# Altium schematic sheet TK514_Interrupter.SchDoc: TK514 Interrupter
size A3; PageSetup: Record=PageOptions|CenterHorizontal=False|CenterVertical=False|PrintScale=0.97|XCorrection=1.00|YCorrection=1.00|PrintKind=1|BorderSize=5000000|LeftOffset=0|BottomOffset=0|Orientation=2|PaperLength=1000|PaperWidth=1000|Scale=100|PaperSource=7|PrintQuality=-4|MediaType=1|DitherType=10|PaperKind=A4|PrintScaleMode=1; Author: Øystein Smith; Organization: Omega Verksted; DocumentNumber: 8; Revision: 0; SheetNumber: 8; SheetTotal: 20
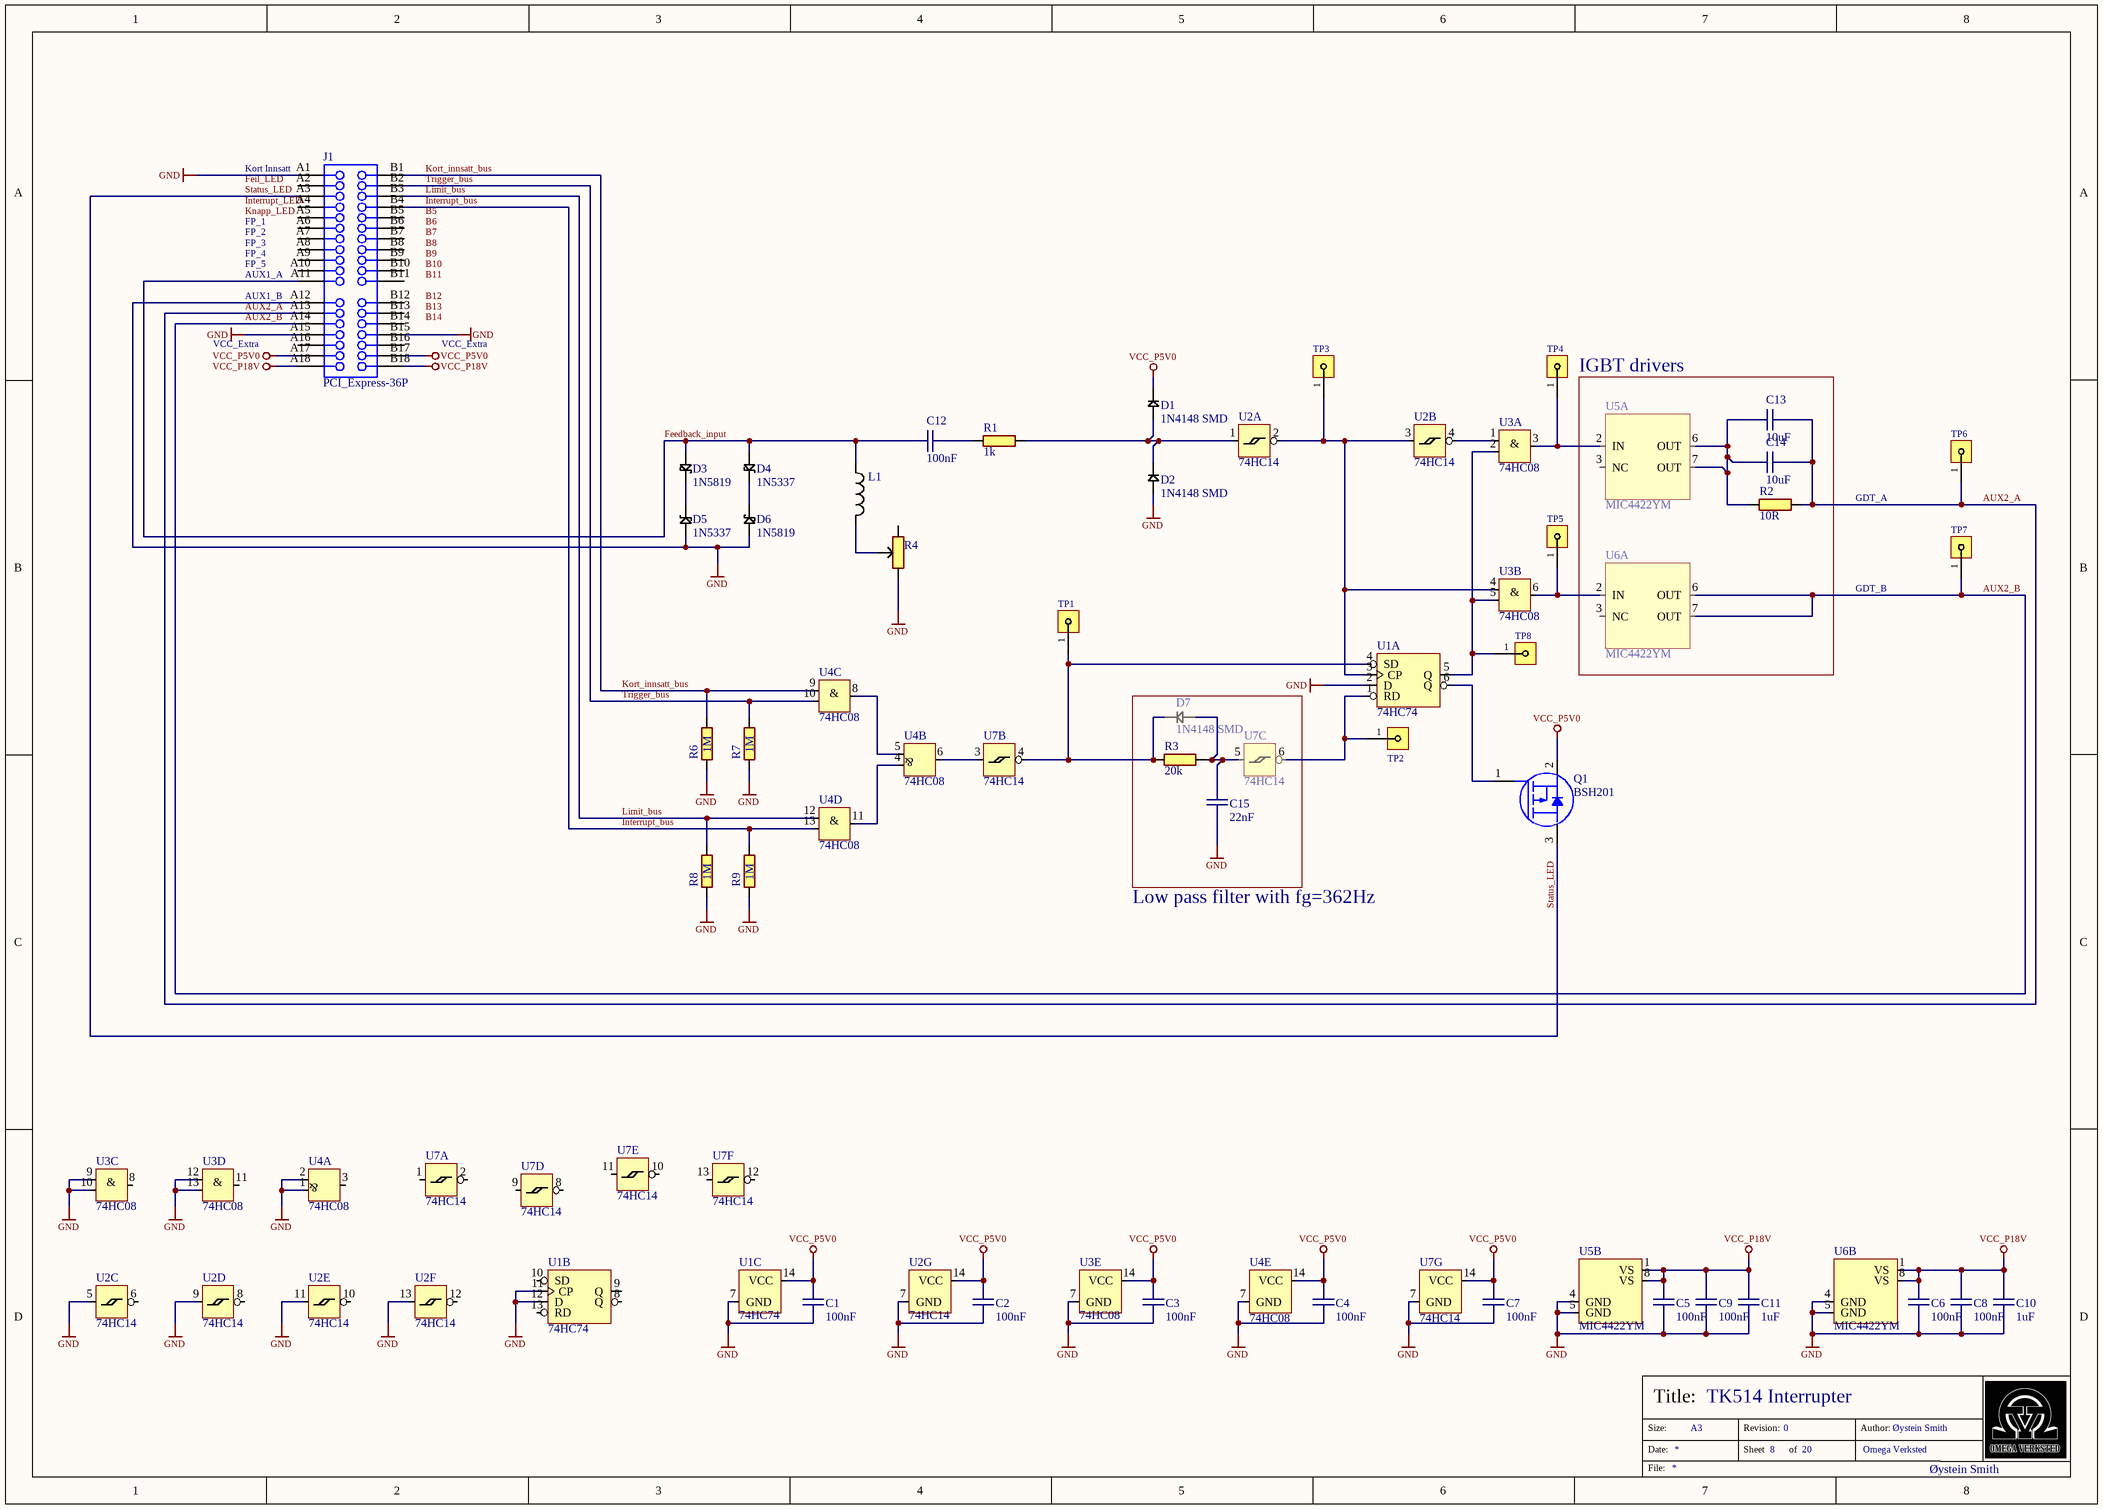
[diagram p0: TK514_Interrupter.SchDoc]

## Parts
C1  100nF  [CAPC0603(1608)55_N]
C2  100nF  [CAPC0603(1608)55_N]
C3  100nF  [CAPC0603(1608)55_N]
C4  100nF  [CAPC0603(1608)55_N]
C5  100nF  [CAPC0603(1608)55_N]
C6  100nF  [CAPC0603(1608)55_N]
C7  100nF  [CAPC0603(1608)55_N]
C8  100nF  [CAPC0603(1608)55_N]
C9  100nF  [CAPC0603(1608)55_N]
C10  1uF  [CAPC1206(3216)170_N]
C11  1uF  [CAPC1206(3216)170_N]
C12  100nF  [CAPC0603(1608)55_N]
C13  10uF  [CAPC1206(3216)170_N]
C14  10uF  [CAPC1206(3216)170_N]
C15  22nF  [CAPC0805(2012)100_N]
D1  1N4148 SMD  [SOD123]
D2  1N4148 SMD  [SOD123]
D3  1N5819  [DO-41]
D4  1N5337  [DO-29]
D5  1N5337  [DO-29]
D6  1N5819  [DO-41]
D7  1N4148 SMD  [SOD123]
J1  PCI_Express-36P  [PCIeX1-GF-2D-1000-1K-O36]
L1  Spole 15H  [INDP3225X20N]  (value not drawn)
Q1  BSH201  [SOT23-3_N]
R1  1k  [RESC0603(1608)_N]
R2  10R  [RESC0805(2012)_N]
R3  20k  [RESC0603(1608)_N]
R4  Trimmepot 100ohm  [TRIMPOT_3006P]  (value not drawn)
R6  1M  [RESC0603(1608)_N]
R7  1M  [RESC0603(1608)_N]
R8  1M  [RESC0603(1608)_N]
R9  1M  [RESC0603(1608)_N]
TP1  Header1x1  [HDRV1W64P254_1X1_254X254X900B]  (value not drawn)
TP2  Header1x1  [HDRV1W64P254_1X1_254X254X900B]  (value not drawn)
TP3  Header1x1  [HDRV1W64P254_1X1_254X254X900B]  (value not drawn)
TP4  Header1x1  [HDRV1W64P254_1X1_254X254X900B]  (value not drawn)
TP5  Header1x1  [HDRV1W64P254_1X1_254X254X900B]  (value not drawn)
TP6  Header1x1  [HDRV1W64P254_1X1_254X254X900B]  (value not drawn)
TP7  Header1x1  [HDRV1W64P254_1X1_254X254X900B]  (value not drawn)
TP8  Header1x1  [HDRV1W64P254_1X1_254X254X900B]  (value not drawn)
U1  74HC74  [SOIC-14]  (parts A,B,C of 3)
U2  74HC14  [SOIC-14]  (parts A,B,C,D,E,F,G of 7)
U3  74HC08  [SOIC-14]  (parts A,B,C,D,E of 5)
U4  74HC08  [SOIC-14]  (parts A,B,C,D,E of 5)
U5  MIC4422YM  [SOIC-8-WIDE]  (parts A,B of 2)
U6  MIC4422YM  [SOIC-8-WIDE]  (parts A,B of 2)
U7  74HC14  [SOIC-14]  (parts A,B,C,D,E,F,G of 7)

## Blocks framed on the sheet
IGBT drivers: C13 C14 R2 U5 U6

## Nets
GND: C1.1 C2.1 C3.1 C4.1 C5.1 C6.1 C7.1 C8.1 C9.1 C10.1 C11.1 C15.1 D2.1(A) D5.1(A) D6.1(A) J1.A1 J1.A12 J1.A15 J1.B15 R4.1 R6.1 R7.1 R8.1 R9.1 U1.2(D) U1.7(GND) U1.11(CP) U1.12(D) U2.5 U2.7(GND) U2.9 U2.11 U2.13 U3.7(GND) U3.9 U3.10 U3.12 U3.13 U4.1 U4.2 U4.7(GND) U5.4(GND) U5.5(GND) U6.4(GND) U6.5(GND) U7.7(GND)
VCC_P5V0: C1.2 C2.2 C3.2 C4.2 C7.2 D1.2(K) J1.A17 J1.B17 Q1.2(Source) U1.14(VCC) U2.14(VCC) U3.14(VCC) U4.14(VCC) U7.14(VCC)
VCC_P18V: C5.2 C6.2 C8.2 C9.2 C10.2 C11.2 J1.A18 J1.B18 U5.1(VS) U5.8(VS) U6.1(VS) U6.8(VS)
AUX2_A: C13.2 C14.2 J1.A13 R2.2 TP6.1
AUX2_B: J1.A14 TP7.1 U6.6(OUT) U6.7(OUT)
Feedback_input: C12.1 D3.1(A) D4.1(A) J1.A11 L1.1
Interrupt_bus: J1.B4 R9.2 U4.13
Kort_innsatt_bus: J1.B1 R6.2 U4.9
Limit_bus: J1.B3 R8.2 U4.12
Status_LED: J1.A3 Q1.3(Drain)
Trigger_bus: J1.B2 R7.2 U4.10
NetC12_2: C12.2 R1.1
NetC13_1: C13.1 C14.1 R2.1 U5.6(OUT) U5.7(OUT)
NetC15_2: C15.2 D7.1(A) R3.2 U7.5
NetD1_1: D1.1(A) D2.2(K) R1.2 U2.1
NetD3_2: D3.2(K) D5.2(K)
NetD4_2: D4.2(K) D6.2(K)
NetD7_2: D7.2(K) R3.1 TP1.1 U1.4(SD) U7.4
NetL1_2: L1.2 R4.2
NetQ1_1: Q1.1(Gate) U1.6(Q)
NetTP2_1: TP2.1 U1.1(RD) U7.6
NetTP3_1: TP3.1 U1.3(CP) U2.2 U2.3 U3.4
NetTP4_1: TP4.1 U3.3 U5.2(IN)
NetTP5_1: TP5.1 U3.6 U6.2(IN)
NetTP8_1: TP8.1 U1.5(Q) U3.2 U3.5
NetU2_4: U2.4 U3.1
NetU4_4: U4.4 U4.11
NetU4_5: U4.5 U4.8
NetU4_6: U4.6 U7.3

Not connected (* = marked no-connect by the designer): J1 A2 A4 A5 A6 A7 A8 A9 A10 A16 B5 B6 B7 B8 B9 B10 B11 B12 B13 B14 B16; R4 3; U1 8(Q) 9(Q) 10(SD) 13(RD); U2 6 8 10 12; U3 8 11; U4 3; U5 3(NC); U6 3(NC); U7 1 2 8 9 10 11 12 13

## Notes on the sheet
- (near J1) Kort Innsatt
- FP_1
- FP_2
- FP_3
- FP_4
- FP_5
- (near J1) AUX1_B
- (near J1) AUX1_A
- VCC_Extra
- GDT_A
- GDT_B
- Low pass filter with fg=362Hz
- Øystein Smith
- Labels drawn without touching a wire or pin: B5, B6, B7, B8, B9, B10, B11, B12, B13, B14, Feil_LED, Interrupt_LED, Knapp_LED
- Size:
- Date:
- Title:
- A3
- Revision:
- Sheet
- of
- Author:
- File:
- (in symbol 3238, part A) &
- (in symbol 3238, part B) &
- (in symbol 3238, part C) &
- (in symbol 3238, part D) &

## Library data of the parts
C1-C9 C12 = 5152: X7R 50V 5%; id: 5152; pakke_opprettet_av: 815; leverandor_varenr: 1759122; pris: 1; nokkelord: Kondensator, Capacitor, CAP; produsent: Multicomp; leverandor: Farnell; pakketype: 0603; rad: 21; rom: OV; lager_type: Baklager; dybde: 0; antall: 1000; komponenttype: 2; pakke_opprettet: 18/02/2015 14:18:13; symbol_opprettet_av: 815; symbol_opprettet: 14/11/2014 20:19:34; navn: 100nF; hylle: 0
C10 C11 = 5154: X7R 50V; id: 5154; pakke_opprettet_av: 815; leverandor_varenr: 1759454; pris: 2; nokkelord: Kondensator, capacitor; produsent: Multicomp; leverandor: Farnell; pakketype: 1206; pakke_opprettet: 11/02/2015 13:21:22; symbol_opprettet_av: 815; symbol_opprettet: 14/11/2014 20:19:34; navn: 1uF; komponenttype: 2
C13 C14 = 5059: X5R 50V 10%; id: 5059; pakke_opprettet_av: 815; leverandor_varenr: 2672214; pris: 6; nokkelord: Kondensator, capacitor; produsent: Murata; leverandor: Farnell; pakketype: 1206; komponenttype: 2; pakke_opprettet: 11/02/2015 13:21:22; symbol_opprettet_av: 815; symbol_opprettet: 14/11/2014 20:19:34; navn: 10uF
C15 = 3491: X7R 50V; id: 3491; pakke_opprettet_av: 815; pris: 1; nokkelord: Capacitor Cap Kondis; pakketype: 0805; rad: 5; rom: OV; lager_type: Baklager; dybde: 2; hylle: 4; antall: 15; leverandor_varenr: 1414682; produsent: Multicomp; leverandor: Farnell; pakke_opprettet: 14/11/2014 20:52:01; symbol_opprettet_av: 815; symbol_opprettet: 14/11/2014 20:19:34; navn: 22nF; komponenttype: 2
D1 D2 D7 = 4485: SMD signaldiode; id: 4485; rad: 3; rom: OV; lager_type: Fremlager; dybde: 2; antall: 894; pakke_opprettet_av: 1165; symbol_opprettet_av: 815; leverandor_varenr: 8150206; pris: 1; produsent: Taiwan Semiconductor; leverandor: Farnell; komponenttype: 9; hylle: 2; pakke_opprettet: 11/05/2018 20:10:55; symbol_opprettet: 28/06/2014 15:10:17; navn: 1N4148 SMD; pakketype: SOD123
D3 D6 = 5238: Schottkydiode, 1A, 40V; id: 5238; rad: 0; rom: OV; lager_type: Fremlager; hylle: 2; antall: 25; pakke_opprettet_av: 815; leverandor_varenr: 1336533; nokkelord: schottky, diode; produsent: Multicomp; leverandor: Farnell; pakketype: DO; komponenttype: 9; dybde: 0; pakke_opprettet: 28/06/2014 16:50:18; symbol_opprettet_av: 815; symbol_opprettet: 28/06/2014 15:20:09; navn: 1N5819; pris: 2
D4 D5 = 3264: Zenerdiode 4.7V 5W; id: 3264; pakke_opprettet_av: 815; leverandor_varenr: 9557946; pris: 5; produsent: ON Semiconductor; leverandor: Farnell; pakketype: DO; komponenttype: 9; pakke_opprettet: 28/06/2014 16:16:55; symbol_opprettet_av: 815; symbol_opprettet: 28/06/2014 15:11:05; navn: 1N5337
J1 = 3037: PCI express PCB kortkankonnektor; pakke_opprettet_av: 815; pris: 0; id: 3037; komponenttype: 11; produsent: PCB feature; navn: PCIeX1-GF-2D-1000-1K-O36; pakke_opprettet: 07/06/2015 17:49:10; symbol_opprettet_av: 815; symbol_opprettet: 06/07/2014 17:26:37; pakketype: -
L1 = 6201: Wirewound Inductor, 15 µH, 2.8 ohm, 20 MHz, 130 mA; id: 6201; pakke_opprettet_av: 924; pris: 4; pakketype: 1210; leverandor_varenr: 2747875; nokkelord: Spole, coil, inductor, wirewound; produsent: TDK; leverandor: Farnell; komponenttype: 3; pakke_opprettet: 26/05/2015 23:51:10; symbol_opprettet_av: 924; symbol_opprettet: 27/05/2015 00:20:21; navn: Spole 15H
Q1 = 3085: P-Channel MOSFET 300mA; id: 3085; pakke_opprettet_av: 815; symbol_opprettet_av: 1150; leverandor_varenr: 1758073; pris: 3; produsent: NXP Semiconductors; leverandor: Farnell; pakketype: SOT; rom: OV; lager_type: Fremlager; dybde: 0; antall: 51; komponenttype: 4; Status: New; pakke_opprettet: 08/07/2014 20:37:25; symbol_opprettet: 14/09/2016 17:47:57; navn: BSH201; rad: 3; hylle: 3
R1 = 5339: 0.1W 1% Thick film resistor; id: 5339; pakke_opprettet_av: 815; leverandor_varenr: 2447272; pris: 0; nokkelord: Resistor Motstand; produsent: Multicomp; leverandor: Farnell; pakketype: 0603; komponenttype: 1; pakke_opprettet: 08/07/2014 21:15:30; symbol_opprettet_av: 815; symbol_opprettet: 08/07/2014 21:16:33; navn: 1k
R2 = 5040: 0.1W 1% Thick film resistor; id: 5040; pakke_opprettet_av: 815; pris: 0; nokkelord: Resistor Motstand; produsent: Multicomp; pakketype: 0805; rad: 2; rom: OV; lager_type: Fremlager; hylle: 6; antall: 200; komponenttype: 1; leverandor: Farnell; leverandor_varenr: 2447556; pakke_opprettet: 27/01/2016 14:23:16; symbol_opprettet_av: 815; symbol_opprettet: 08/07/2014 21:16:33; navn: 10R; dybde: 0
R3 = 5357: 0.1W 1% Thick film resistor; id: 5357; rad: -1; rom: OV; lager_type: Fremlager; dybde: 79; hylle: 2; antall: 3; pakke_opprettet_av: 815; pris: 0; pakketype: 0603; komponenttype: 1; leverandor: Farnell; leverandor_varenr: 2447293; produsent: Multicomp; pakke_opprettet: 08/07/2014 21:15:30; symbol_opprettet_av: 815; symbol_opprettet: 08/07/2014 21:16:33; navn: 20k
R4 = 3823: 15 turn, horizontal; id: 3823; rad: 1; rom: OV; lager_type: Fremlager; dybde: 0; hylle: 3; antall: 54; pakke_opprettet_av: 815; leverandor_varenr: 9352279; pris: 15; nokkelord: trimpot; produsent: Bourns; leverandor: Farnell; pakketype: TH; pakke_opprettet: 10/02/2017 15:29:47; symbol_opprettet_av: 815; symbol_opprettet: 03/11/2016 15:34:07; navn: Trimmepot 100ohm; komponenttype: 1
R6-R9 = 5340: 0.1W 1% Thick film resistor; id: 5340; rad: -1; rom: OV; lager_type: Fremlager; dybde: 119; hylle: 2; antall: 100; pakke_opprettet_av: 815; pris: 0; nokkelord: Resistor Motstand; pakketype: 0603; komponenttype: 1; leverandor: Farnell; leverandor_varenr: 2073358; produsent: Multicomp; pakke_opprettet: 08/07/2014 21:15:30; symbol_opprettet_av: 815; symbol_opprettet: 08/07/2014 21:16:33; navn: 1M
TP1-TP8 = 5093: 2,54mm pitch; id: 5093; pakke_opprettet_av: 815; pris: 1; pakketype: TH; komponenttype: 11; pakke_opprettet: 13/11/2014 12:30:32; symbol_opprettet_av: 815; symbol_opprettet: 13/11/2014 10:58:46; navn: Header 1x1
U1 = 3211: Dual D flip flop; id: 3211; pakke_opprettet_av: 815; leverandor_varenr: 9591680; pris: 4; nokkelord: Logikk; produsent: Texas Instruments; leverandor: Farnell; pakketype: SOIC; komponenttype: 8; pakke_opprettet: 28/06/2014 18:13:44; symbol_opprettet_av: 815; symbol_opprettet: 28/06/2014 15:25:05; navn: 74HC74
U2 U7 = 4400: Hex Schmitt trigger; id: 4400; pakke_opprettet_av: 815; leverandor_varenr: 1607772; pris: 4; nokkelord: Logikk; produsent: ON Semiconductor; leverandor: Farnell; pakketype: SOIC; komponenttype: 8; pakke_opprettet: 28/06/2014 18:13:44; symbol_opprettet_av: 815; symbol_opprettet: 28/06/2014 15:23:38; navn: 74HC14
U3 U4 = 3238: Quad And Gate; id: 3238; rad: 0; rom: OV; lager_type: Fremlager; dybde: 17; hylle: 1; antall: 60; pakke_opprettet_av: 815; leverandor_varenr: 9590986; pris: 3; produsent: Toshiba; leverandor: Farnell; pakketype: SOIC; komponenttype: 8; pakke_opprettet: 28/06/2014 18:13:44; symbol_opprettet_av: 815; symbol_opprettet: 28/06/2014 15:22:08; navn: 74HC08
U5 U6 = 3223: Mosfet Driver; id: 3223; pakke_opprettet_av: 815; leverandor_varenr: 2510119; pris: 20; produsent: Microchip; leverandor: Farnell; pakketype: SOIC; pakke_opprettet: 28/06/2014 18:39:37; symbol_opprettet_av: 815; symbol_opprettet: 28/06/2014 15:39:18; navn: MIC4422YM